# Altium schematic sheet Chanel_2.SchDoc
size A4
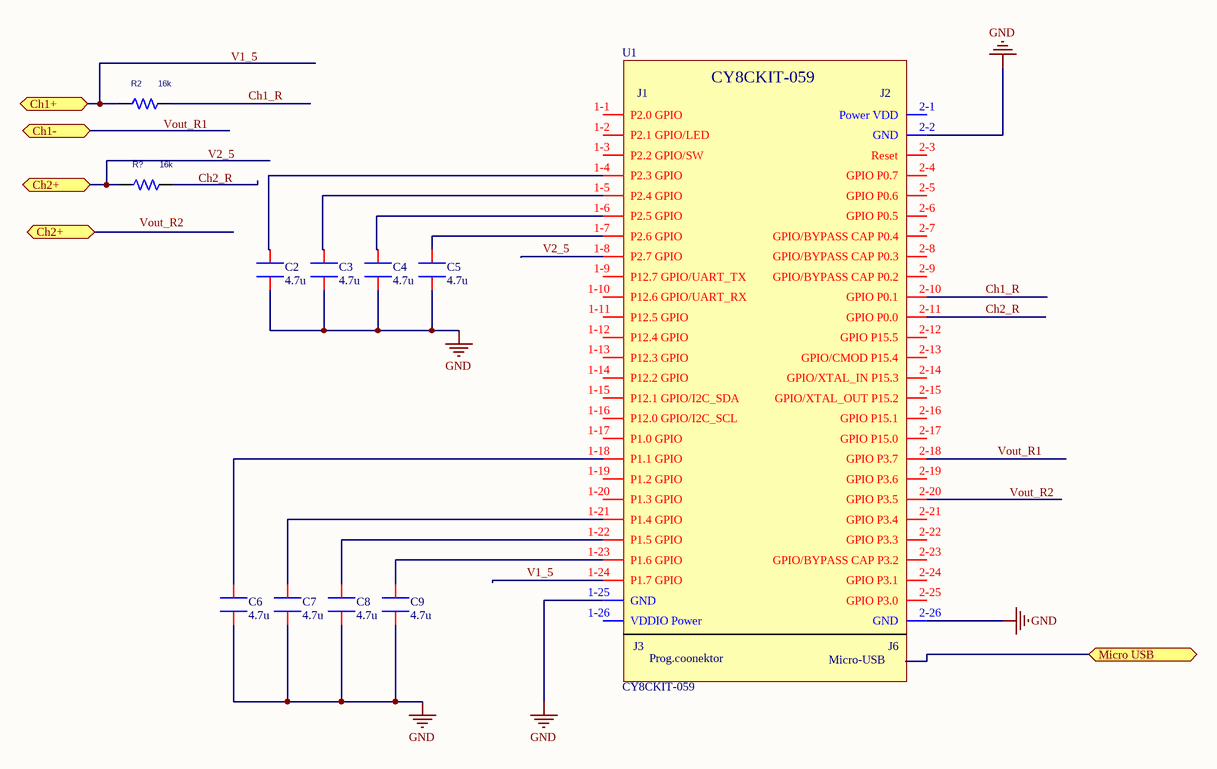
[diagram p0: Chanel_2.SchDoc]

## Parts
C2  4.7u  [SMD0805]
C3  4.7u  [SMD0805]
C4  4.7u  [SMD0805]
C5  4.7u  [SMD0805]
C6  4.7u  [SMD0805]
C7  4.7u  [SMD0805]
C8  4.7u  [SMD0805]
C9  4.7u  [SMD0805]
R2  16k  [SMD1206]
R?  16k  [SMD1206]
U1  CY8CKIT-059  [CY8CKIT-059]

## Ports
Ch1+, Ch1-, Ch2+, Micro USB (bidir)

## Nets
GND: C2.1 C3.1 C4.1 C5.1 C6.1 C7.1 C8.1 C9.1 U1.1-25(GND) U1.2-2(GND) U1.2-26(GND)
Ch1+: R2.1 ; port Ch1+
Ch1_R: R2.2 U1.2-10(GPIO_P0.1)
Ch2+: R?.1 ; port Ch2+
Ch2_R: U1.2-11(GPIO_P0.0)
V1_5: U1.1-24(P1.7_GPIO)
V2_5: U1.1-8(P2.7_GPIO)
Vout_R1: U1.2-18(GPIO_P3.7)
NetC2_2: C2.2 U1.1-4(P2.3_GPIO)
NetC3_2: C3.2 U1.1-5(P2.4_GPIO)
NetC4_2: C4.2 U1.1-6(P2.5_GPIO)
NetC5_2: C5.2 U1.1-7(P2.6_GPIO)
NetC6_2: C6.2 U1.1-18(P1.1_GPIO)
NetC7_2: C7.2 U1.1-21(P1.4_GPIO)
NetC8_2: C8.2 U1.1-22(P1.5_GPIO)
NetC9_2: C9.2 U1.1-23(P1.6_GPIO)

Not connected (* = marked no-connect by the designer): R? 2; U1 1-1(P2.0_GPIO) 1-2(P2.1_GPIO/LED) 1-3(P2.2_GPIO/SW) 1-9(P12.7_GPIO/UART_TX) 1-10(P12.6_GPIO/UART_RX) 1-11(P12.5_GPIO) 1-12(P12.4_GPIO) 1-13(P12.3_GPIO) 1-14(P12.2_GPIO) 1-15(P12.1_GPIO/I2C_SDA) 1-16(P12.0_GPIO/I2C_SCL) 1-17(P1.0_GPIO) 1-19(P1.2_GPIO) 1-20(P1.3_GPIO) 1-26(VDDIO_Power) 2-1(Power_VDD) 2-3(Reset) 2-4(GPIO_P0.7) 2-5(GPIO_P0.6) 2-6(GPIO_P0.5) 2-7(GPIO/BYPASS_CAP_P0.4) 2-8(GPIO/BYPASS_CAP_P0.3) 2-9(GPIO/BYPASS_CAP_P0.2) 2-12(GPIO_P15.5) 2-13(GPIO/CMOD_P15.4) 2-14(GPIO/XTAL_IN_P15.3) 2-15(GPIO/XTAL_OUT_P15.2) 2-16(GPIO_P15.1) 2-17(GPIO_P15.0) 2-19(GPIO_P3.6) 2-20(GPIO_P3.5) 2-21(GPIO_P3.4) 2-22(GPIO_P3.3) 2-23(GPIO/BYPASS_CAP_P3.2) 2-24(GPIO_P3.1) 2-25(GPIO_P3.0)

## Notes on the sheet
- Labels drawn without touching a wire or pin: Ch2_R, V1_5, V2_5, Vout_R1, Vout_R2
- (in symbol CY8CKIT-059) J1; J2; J3; J6; Prog.coonektor; Micro-USB

## Library data of the parts
C2-C9 = CAP: value: 4.7u
R2 R? = R: TC2: 0; POWER: RMAX; MAX_TEMP: RTMAX; SLOPE: RSMAX; VOLTAGE: RVMAX; PSpiceTemplate: R^@REFDES %1 %2 ?TOLERANCE|R^@REFDES| @VALUE TC=@TC1,@TC2 ?TOLERANCE|\n.model R^@REFDES RES R=1 DEV=@TOLERANCE% TC1=@TC1 TC2=@TC2|; DIST: FLAT; TC1: 0; Value: 16k